# Altium schematic sheet Sheet1.SchDoc
size A4; SheetNumber: 1; SheetTotal: 1
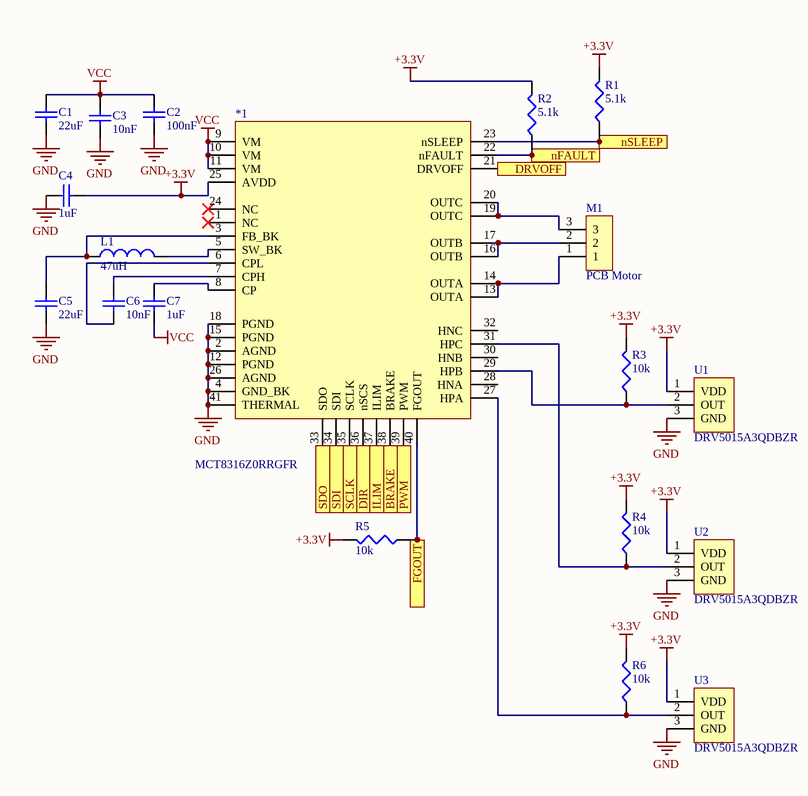
[diagram p0: Sheet1.SchDoc]

## Parts
*1  MCT8316Z0RRGFR  [MCF8315A]
C1  22uF  [CAPC1005X56X25ML10T15]
C2  100nF  [CAPC1005X56X25ML10T15]
C3  10nF  [CAPC1005X56X25ML10T15]
C4  1uF  [CAPC1005X56X25ML10T15]
C5  22uF  [CAPC1005X56X25ML10T15]
C6  10nF  [CAPC1005X56X25ML10T15]
C7  1uF  [CAPC1005X56X25ML10T15]
L1  47uH  [RESC0603X02N]
M1  PCB Motor  [PCB Motor 6Sv5]
R1  5.1k  [RESC1005X03N]
R2  5.1k  [RESC1005X03N]
R3  10k  [RESC1005X03N]
R4  10k  [RESC1005X03N]
R5  10k  [RESC1005X03N]
R6  10k  [RESC1005X03N]
U1  DRV5015A3QDBZR  [SOT95P237X95-3N]
U2  DRV5015A3QDBZR  [SOT95P237X95-3N]
U3  DRV5015A3QDBZR  [SOT95P237X95-3N]

## Ports
BRAKE (in), DIR (in), DRVOFF (in), FGOUT (in), ILIM (in), nFAULT (in), nSLEEP (in), PWM (in), SCLK (in), SDI (in), SDO (in)

## Nets
+3.3V: *1.25(AVDD) C4.2 R1.2 R2.2 R3.2 R4.2 R5.2 R6.2 U1.1(VDD) U2.1(VDD) U3.1(VDD)
GND: *1.2(AGND) *1.4(GND_BK) *1.12(PGND) *1.15(PGND) *1.18(PGND) *1.26(AGND) *1.41(THERMAL) C1.1 C2.1 C3.1 C4.1 C5.2 U1.3(GND) U2.3(GND) U3.3(GND)
VCC: *1.9(VM) *1.10(VM) *1.11(VM) C1.2 C2.2 C3.2 C7.2
BRAKE: *1.38(BRAKE) ; port BRAKE
DIR: *1.36(nSCS) ; port DIR
DRVOFF: *1.21(DRVOFF) ; port DRVOFF
FGOUT: *1.40(FGOUT) R5.1 ; port FGOUT
ILIM: *1.37(ILIM) ; port ILIM
nFAULT: *1.22(nFAULT) R2.1 ; port nFAULT
nSLEEP: *1.23(nSLEEP) R1.1 ; port nSLEEP
PWM: *1.39(PWM) ; port PWM
SCLK: *1.35(SCLK) ; port SCLK
SDI: *1.34(SDI) ; port SDI
SDO: *1.33(SDO) ; port SDO
Net*1_3: *1.3(FB_BK) C5.1 L1.1
Net*1_5: *1.5(SW_BK) L1.2
Net*1_6: *1.6(CPL) C6.2
Net*1_7: *1.7(CPH) C6.1
Net*1_8: *1.8(CP) C7.1
Net*1_13: *1.13(OUTA) *1.14(OUTA) M1.1
Net*1_16: *1.16(OUTB) *1.17(OUTB) M1.2
Net*1_19: *1.19(OUTC) *1.20(OUTC) M1.3
Net*1_27: *1.27(HPA) R6.1 U3.2(OUT)
Net*1_29: *1.29(HPB) R3.1 U1.2(OUT)
Net*1_31: *1.31(HPC) R4.1 U2.2(OUT)

Not connected (* = marked no-connect by the designer): *1 1(NC)* 24(NC)* 28(HNA) 30(HNB) 32(HNC)

## Library data of the parts
*1 = MCF8315A
C1 = CMP-2008-02800-1: 'LMK105BJ225MV-F; Manufacturer: AVX Interconnect / Elco; Part Number: 0402YC104KAT2A
C2-C7 = CMP-2008-02799-1: '04025C103MAT2A; Manufacturer: AVX Interconnect / Elco; Part Number: 0402YC103MAT2A
L1 = IND
R1-R6 = RES